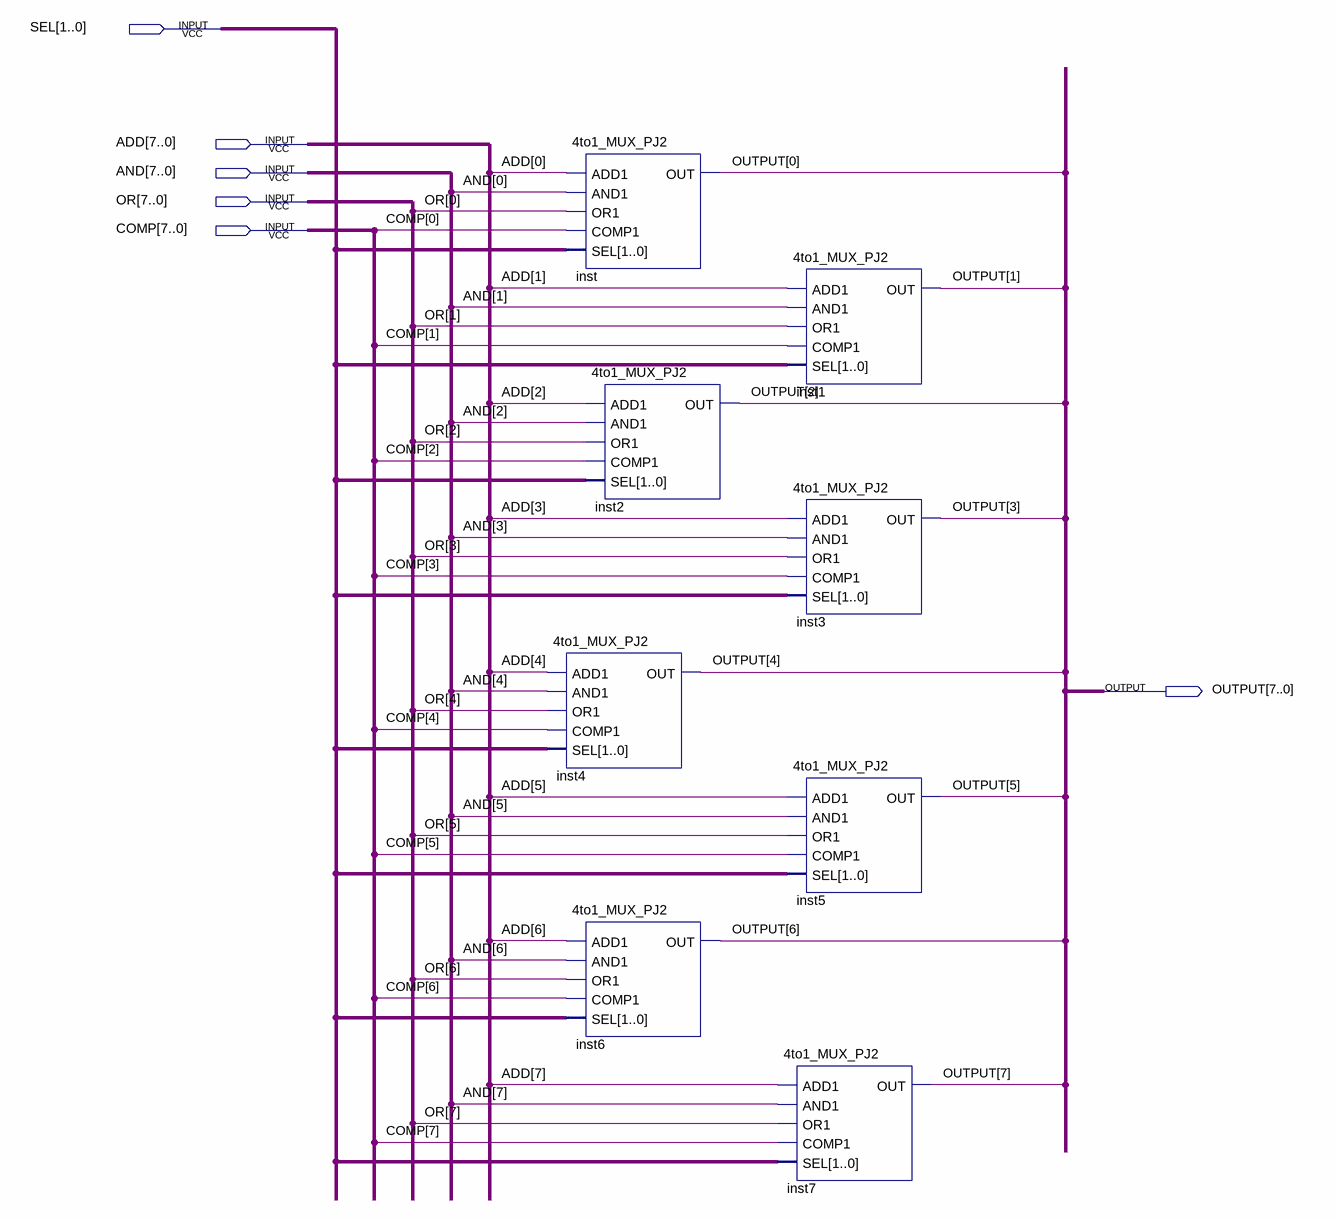
[diagram p0: schematic sheet]
// Quartus schematic MUX-ALU.bdf as structural Verilog: 8 symbols, 6 pins
module \MUX-ALU  (
  input  [1:0] SEL,
  input  [7:0] ADD,
  input  [7:0] AND,
  input  [7:0] OR,
  input  [7:0] COMP,
  output [7:0] OUTPUT
);

  \4to1_MUX_PJ2  inst (.ADD1(ADD[0]), .AND1(AND[0]), .OR1(OR[0]), .COMP1(COMP[0]), .SEL(SEL), .OUT(OUTPUT[0]));
  \4to1_MUX_PJ2  inst4 (.ADD1(ADD[4]), .AND1(AND[4]), .OR1(OR[4]), .COMP1(COMP[4]), .SEL(SEL), .OUT(OUTPUT[4]));
  \4to1_MUX_PJ2  inst6 (.ADD1(ADD[6]), .AND1(AND[6]), .OR1(OR[6]), .COMP1(COMP[6]), .SEL(SEL), .OUT(OUTPUT[6]));
  \4to1_MUX_PJ2  inst2 (.ADD1(ADD[2]), .AND1(AND[2]), .OR1(OR[2]), .COMP1(COMP[2]), .SEL(SEL), .OUT(OUTPUT[2]));
  \4to1_MUX_PJ2  inst1 (.ADD1(ADD[1]), .AND1(AND[1]), .OR1(OR[1]), .COMP1(COMP[1]), .SEL(SEL), .OUT(OUTPUT[1]));
  \4to1_MUX_PJ2  inst3 (.ADD1(ADD[3]), .AND1(AND[3]), .OR1(OR[3]), .COMP1(COMP[3]), .SEL(SEL), .OUT(OUTPUT[3]));
  \4to1_MUX_PJ2  inst5 (.ADD1(ADD[5]), .AND1(AND[5]), .OR1(OR[5]), .COMP1(COMP[5]), .SEL(SEL), .OUT(OUTPUT[5]));
  \4to1_MUX_PJ2  inst7 (.ADD1(ADD[7]), .AND1(AND[7]), .OR1(OR[7]), .COMP1(COMP[7]), .SEL(SEL), .OUT(OUTPUT[7]));
endmodule
